# EAGLE design DyIOrev13FETFIX (EAGLE 6.6.0)
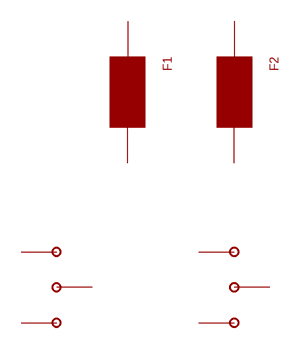
[diagram p0: schematic, sheet 1]

## Parts
F1  0154  [0154]
F2  0154  [0154]
U$1  3PH  [HEADER]
U$2  3PH  [HEADER]
Unconnected: F1.1 F1.2 F2.1 F2.2 U$1.P$1 U$1.P$2 U$1.P$3 U$2.P$1 U$2.P$2 U$2.P$3

## Library data of the parts
F1 F2 = SMT_Fuse_0154001:0154
U$1 U$2 = 3pinh:3PH

## Board
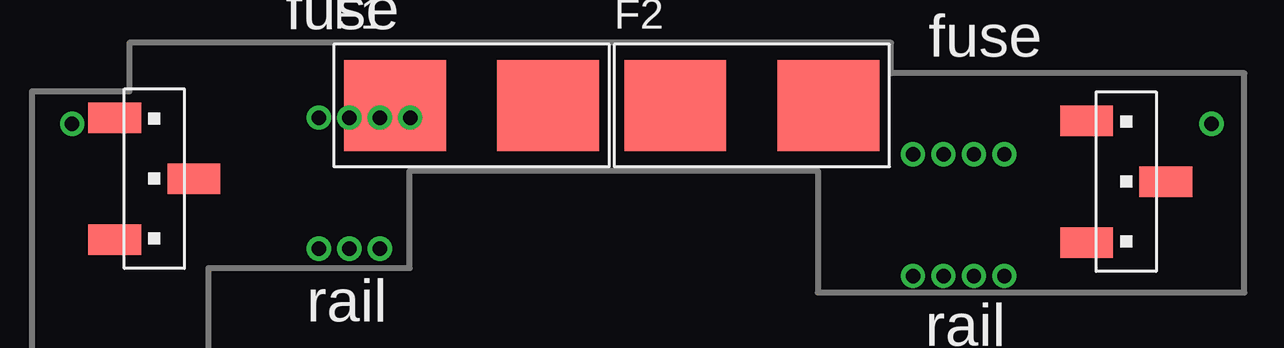
[diagram p1: board, top side]

No outline drawn. Coordinates in mm, seen from the top.
Copper layers (1*16): Top 0.035mm / dielectric 1.5mm / Bottom 0.035mm
Design rules "default": minimum track width 10mil, minimum drill 24mil, track to track 8mil, track to pad 8mil, pad to pad 8mil, via to via 8mil, smd to smd 8mil, copper to edge 40mil, drill to drill 8mil, minimum pad ring 10mil, minimum via ring 8mil, stop-mask expansion 4mil, vias tented up to drill 0mil, thermal gap 10mil

### Footprints (pad centres in the part's own frame; a part is rotated, then mirrored left to right if it is on the bottom)
0154 = smd 4.24 x 3.81: 1 0,0; 2 6.38,0
HEADER = smd 1.27 x 2.2: P$1 -2.54,1.65; P$2 0,-1.65; P$3 2.54,1.65

### Placement (x,y rotation side)
F1  16.26,11.94 0 top
F2  27.94,11.94 0 top
U$1  6.22,8.89 90 top
U$2  46.74,8.76 90 top

### Tracks (layer width: path | path; a pad name or v marks a point on that pad's centre or on a via)
N$1  (via drill 0.6)
  other vias: 37.85,9.91
N$2  (via drill 0.6)
  other vias: 39.12,9.91
N$3  (via drill 0.6)
  other vias: 40.39,9.91
N$4  (via drill 0.6)
  other vias: 41.66,9.91
N$5  (via drill 0.6)
  other vias: 41.66,4.83
N$6  (via drill 0.6)
  other vias: 40.39,4.83
N$7  (via drill 0.6)
  other vias: 39.12,4.83
N$8  (via drill 0.6)
  other vias: 37.85,4.83
N$9  (via drill 0.6)
  other vias: 50.29,11.18
N$10  (via drill 0.6)
  other vias: 2.79,11.18
N$11  (via drill 0.6)
  other vias: 15.62,5.97
N$12  (via drill 0.6)
  other vias: 14.35,5.97
N$13  (via drill 0.6)
  other vias: 13.08,5.97
N$14  (via drill 0.6)
  other vias: 13.08,11.43
N$15  (via drill 0.6)
  other vias: 14.35,11.43
N$16  (via drill 0.6)
  other vias: 15.62,11.43
N$17  (via drill 0.6)
  other vias: 16.89,11.43

### Text on the board
tPlace: fuse | fuse | rail | rail